# EAGLE design endstop-board (EAGLE 9.3.1)
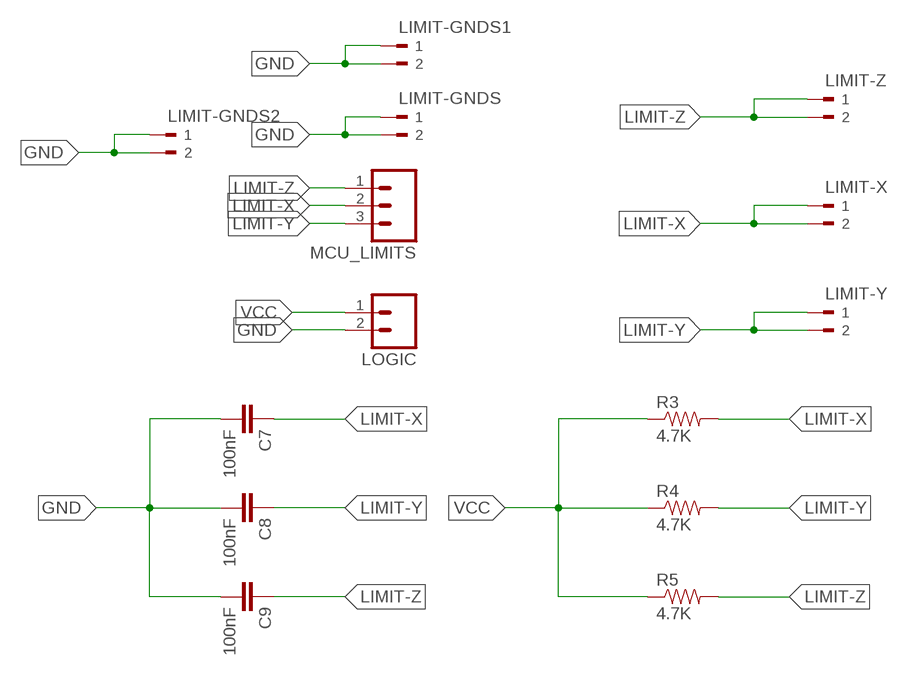
[diagram p0: schematic, sheet 1]

## Parts
C7  100nF  CAP1206  [1206]
C8  100nF  CAP1206  [1206]
C9  100nF  CAP1206  [1206]
LIMIT-GNDS  PM5.08/2/90BLK  [WEIDMULLER_PM5.08_2]
LIMIT-GNDS1  PM5.08/2/90BLK  [WEIDMULLER_PM5.08_2]
LIMIT-GNDS2  PM5.08/2/90BLK  [WEIDMULLER_PM5.08_2]
LIMIT-X  PM5.08/2/90BLK  [WEIDMULLER_PM5.08_2]
LIMIT-Y  PM5.08/2/90BLK  [WEIDMULLER_PM5.08_2]
LIMIT-Z  PM5.08/2/90BLK  [WEIDMULLER_PM5.08_2]
LOGIC  M02  [02P]
MCU_LIMITS  M03  [03P]
R3  4.7K  RESISTOR1206  [1206]
R4  4.7K  RESISTOR1206  [1206]
R5  4.7K  RESISTOR1206  [1206]

## Nets
GND: C7.2 C8.2 C9.2 LIMIT-GNDS1.1 LIMIT-GNDS1.2 LIMIT-GNDS2.1 LIMIT-GNDS2.2 LIMIT-GNDS.1 LIMIT-GNDS.2 LOGIC.2
LIMIT-X: C7.1 LIMIT-X.1 LIMIT-X.2 MCU_LIMITS.2 R3.2
LIMIT-Y: C8.1 LIMIT-Y.1 LIMIT-Y.2 MCU_LIMITS.3 R4.2
LIMIT-Z: C9.1 LIMIT-Z.1 LIMIT-Z.2 MCU_LIMITS.1 R5.2
VCC: LOGIC.1 R3.1 R4.1 R5.1

## Library data of the parts
C7-C9 = 01_SparkFun:CAP: Capacitor Standard 0603 ceramic capacitor, and 0.1" leaded capacitor.
LIMIT-GNDS LIMIT-GNDS1 LIMIT-GNDS2 LIMIT-X LIMIT-Y LIMIT-Z = WEIDMULLER-PM5.08_2_90BLK:PM5.08/2/90BLK: TERMINAL BLOCK, SIDE ENTRY, 2WAY; MPN: PM5.08/2/90 BLK; OC_FARNELL: 1131855; OC_NEWARK: 26M1980; PACKAGE: TH-R/A; SUPPLIER: WEIDMULLER
LOGIC = con-amp-quick:M02: AMP QUICK CONNECTOR; OC_FARNELL: unknown; OC_NEWARK: unknown
MCU_LIMITS = con-amp-quick:M03: AMP QUICK CONNECTOR; OC_FARNELL: unknown; OC_NEWARK: unknown
R3-R5 = 01_SparkFun:RESISTOR: Resistor Basic schematic elements and footprints for 0603, 1206, and PTH 1/10th watt (small) resistors.

## Board
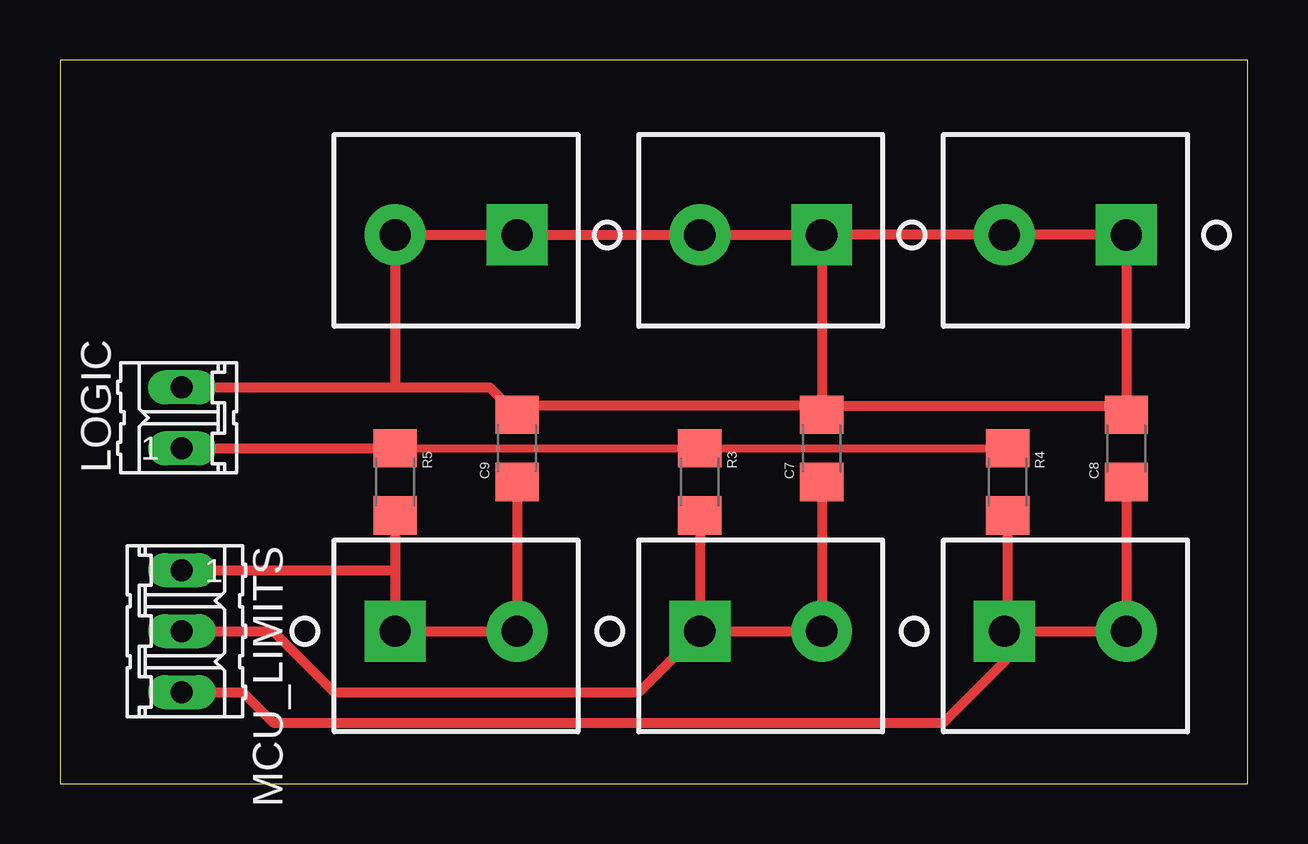
[diagram p1: board, top side]

Size 49.51 x 30.15 mm. Coordinates in mm from the lower left corner, seen from the top.
Outline: 0,0 49.51,0 49.51,30.15 0,30.15 0,0
Copper layers (1*16): Top 0.035mm / dielectric 1.5mm / Bottom 0.035mm
Design rules "default *": minimum track width 6mil, minimum drill 0.35mm, track to track 17mil, track to pad 17mil, pad to pad 17mil, via to via 17mil, smd to smd 17mil, copper to edge 40mil, drill to drill 6mil, minimum pad ring 10mil, minimum via ring 8mil, stop-mask expansion 4mil, vias tented up to drill 0mil, thermal gap 10mil

### Footprints (pad centres in the part's own frame; a part is rotated, then mirrored left to right if it is on the bottom)
1206 = smd 1.6 x 1.8: 1 -1.4,0; 2 1.4,0
WEIDMULLER_PM5.08_2 = drill 1.3 pad 2.54 square: 1 -2.54,0 | drill 1.3 pad 2.54: 2 2.54,0
02P = drill 0.914 long: 1 -1.27,0; 2 1.27,0
03P = drill 0.914 long: 1 -2.54,0; 2 0,0; 3 2.54,0

### Placement (x,y rotation side)
C7  31.75,13.97 90 top
C8  44.45,13.97 90 top
C9  19.05,13.97 90 top
LIMIT-GNDS  16.51,22.86 180 top
LIMIT-GNDS1  29.21,22.86 180 top
LIMIT-GNDS2  41.91,22.86 180 top
LIMIT-X  29.21,6.35 0 top
LIMIT-Y  41.91,6.35 0 top
LIMIT-Z  16.51,6.35 0 top
LOGIC  5.08,15.24 90 top
MCU_LIMITS  5.08,6.35 270 top
R3  26.67,12.57 270 top
R4  39.5,12.57 270 top
R5  13.97,12.57 270 top

### Tracks (layer width: path | path; a pad name or v marks a point on that pad's centre or on a via)
GND
  Top 0.406: C8.2 44.45,15.24 | C7.2 31.88,15.37 32.26,15.75 44.07,15.75 C8.2 | C7.2 31.37,15.75 19.43,15.75 C9.2 17.91,16.51 13.97,16.51 | LOGIC.2 13.97,16.51 | 13.97,16.51 LIMIT-GNDS.2 LIMIT-GNDS.1 LIMIT-GNDS1.2 LIMIT-GNDS1.1 | LIMIT-GNDS1.1 C7.2 | C8.2 LIMIT-GNDS2.1 LIMIT-GNDS2.2 LIMIT-GNDS1.1
LIMIT-X
  Top 0.406: LIMIT-X.1 LIMIT-X.2 C7.1 | MCU_LIMITS.2 8.89,6.35 11.43,3.81 24.13,3.81 LIMIT-X.1 | R3.2 LIMIT-X.1
LIMIT-Y
  Top 0.406: LIMIT-Y.1 LIMIT-Y.2 C8.1 | MCU_LIMITS.3 7.62,3.81 8.89,2.54 36.83,2.54 39.37,5.08 LIMIT-Y.1 | R4.2 39.5,6.48 LIMIT-Y.1
LIMIT-Z
  Top 0.406: C9.1 LIMIT-Z.2 LIMIT-Z.1 13.97,8.89 | R5.2 13.97,8.89 | MCU_LIMITS.1 13.97,8.89
VCC
  Top 0.33: R5.1 14.1,13.97 R3.1 R4.1
  Top 0.406: 13.97,14.1 14.1,13.97 14.09,13.97 LOGIC.1